# Altium schematic sheet PSU_LP5907_2V5.SchDoc
size A4
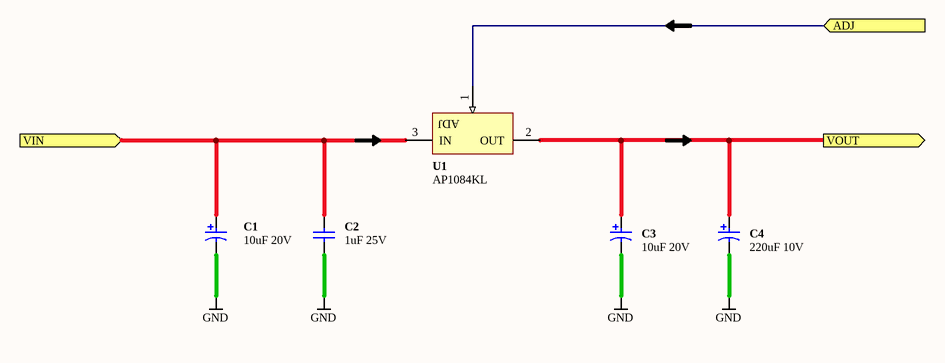
[diagram p0: PSU_LP5907_2V5.SchDoc]

## Parts
C1  10uF 20V  [CAPC3528-STAR]
C2  1uF 25V  [CAPC3216-STAR]
C3  10uF 20V  [CAPC3528-STAR]
C4  220uF 10V  [CAPC7343-STAR]
U1  AP1084KL  [TO254P-3N]

## Ports
ADJ (in), VIN (in), VOUT (out)

## Nets
GND: C1.2 C2.2 C3.2 C4.2
ADJ: U1.1(ADJ) ; port ADJ
VIN: C1.1 C2.1 U1.3(IN) ; port VIN
VOUT: C3.1 C4.1 U1.2(OUT) ; port VOUT

## Library data of the parts
C1 C3 = D-101-0007: Capacitor, Tantalum, 10uF 10% 20V MCCT-B (3528); Polarity: Polarized; Category: Capacitor; Capacitance: 10 uF; Mounting Technology: Surface Mount; Rated Voltage: 20 V; Status: Production; Technology: Tantalum; Tolerance: 10 %
C2 = D-101-0027: Capacitor, Ceramic, 1uF 10% 25V 1206 (3216) X7R; Polarity: Non-Polarized; Capacitance: 1 uF; Dielectric: X7R; Mounting Technology: Surface Mount; Rated Voltage: 25 V; Status: Production; Technology: Ceramic; Tolerance: 10 %; Category: Capacitor
C4 = D-101-0088: Capacitor, Tantalum, 220uF 10% 10V MCCT-D (7343-31); Polarity: Polarized; Category: Capacitor; Capacitance: 220 uF; Mounting Technology: Surface Mount; Rated Voltage: 10 V; Status: Unreleased; Technology: Tantalum; Tolerance: 10 %
U1 = D-204-0033: AP1084KL, 5A Low Dropout Positive Adjustable Regulator; Max Input Voltage: 12V; Max Output Current: 5.1A; Max Output Voltage: mV; Min Input Voltage: -0.3V; Min Output Voltage: mV; Mounting Technology: Surface Mount; Status: Unreleased; Supply Voltage: mV; Temperature Range: -40 - 125 degC; Category: IC-Power